# EAGLE design T2BasicSerialSplitterRevC (EAGLE 7.7.0)
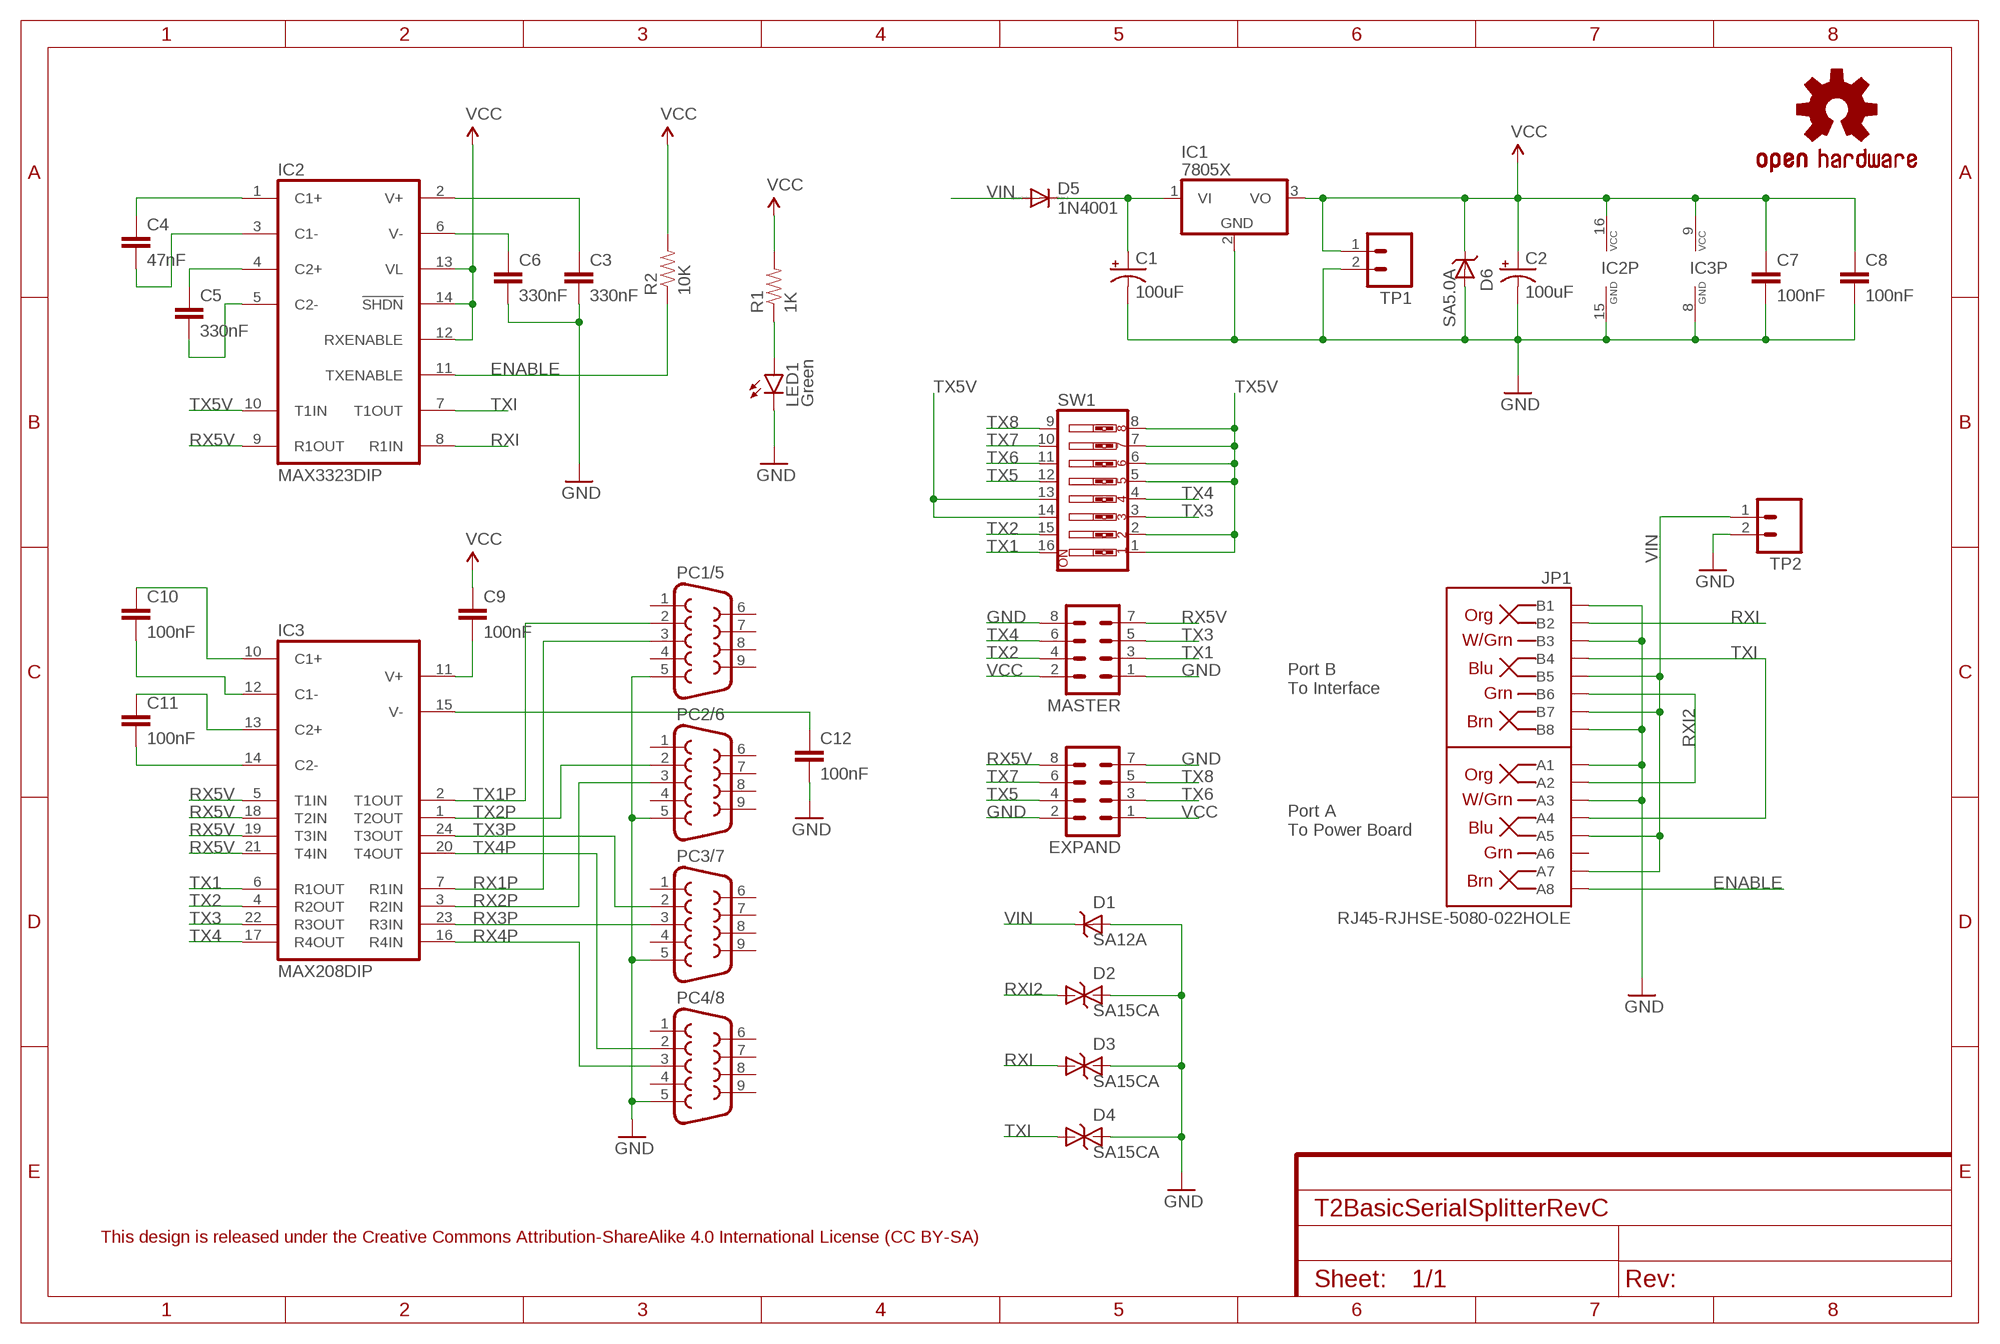
[diagram p0: schematic, sheet 1]
FRAME2 (FRAME-A4L): CNAME: Type 2 Basic Serial Splitter; CREVISION: Rev C 08/2019; DESIGNER: A J Instone-Cowie

## Parts
C1  100uF  CAP_POLPTH1  [CPOL-RADIAL-100UF-25V]
C2  100uF  CAP_POLPTH1  [CPOL-RADIAL-100UF-25V]
C3  330nF  CAPPTH  [CAP-PTH-SMALL]
C4  47nF  CAPPTH  [CAP-PTH-SMALL]
C5  330nF  CAPPTH  [CAP-PTH-SMALL]
C6  330nF  CAPPTH  [CAP-PTH-SMALL]
C7  100nF  CAPPTH  [CAP-PTH-SMALL]
C8  100nF  CAPPTH  [CAP-PTH-SMALL]
C9  100nF  CAPPTH  [CAP-PTH-SMALL]
C10  100nF  CAPPTH  [CAP-PTH-SMALL]
C11  100nF  CAPPTH  [CAP-PTH-SMALL]
C12  100nF  CAPPTH  [CAP-PTH-SMALL]
D1  SA12A  [DO41_TVS_UNI]
D2  SA15CA  [DO41_TVS_BI]
D3  SA15CA  [DO41_TVS_BI]
D4  SA15CA  [DO41_TVS_BI]
D5  1N4001  [DO41_DIODE]
D6  SA5.0A  [DO41_TVS_UNI]
EXPAND  M04X2POL  [2X4-POLARISED]
IC1  7805X  [TO220H]
IC2  MAX3323DIP  [DIL16]
IC3  MAX208DIP  [DIL24]
JP1  RJ45-RJHSE-5080-022HOLE  [RJ45-RJHSE-5080-02]
LED1  Green  LED-LH3MM  [LED3MM_LARGEHOLES]
LOGO1  OSHW-LOGOS  [OSHW-LOGO-S]
MASTER  M04X2POL  [2X4-POLARISED]
PC1/5  DB9-CONNECTOR-PCBFEMALE  [MULTICOMP-DB9-FEMALE-PCB-90DEG]
PC2/6  DB9-CONNECTOR-PCBFEMALE  [MULTICOMP-DB9-FEMALE-PCB-90DEG]
PC3/7  DB9-CONNECTOR-PCBFEMALE  [MULTICOMP-DB9-FEMALE-PCB-90DEG]
PC4/8  DB9-CONNECTOR-PCBFEMALE  [MULTICOMP-DB9-FEMALE-PCB-90DEG]
R1  1K  RESISTORPTH-1/4W  [AXIAL-0.4]
R2  10K  RESISTORPTH-1/4W  [AXIAL-0.4]
SW1  SW_DIP-8  [DIPSWITCH-08]
TP1  M02PTH  [1X02]
TP2  M02PTH  [1X02]

## Nets
ENABLE: IC2.11(TXENABLE) JP1.A8 R2.P$1
GND: C1.2(-) C2.2(-) C3.2 C6.2 C7.2 C8.2 C12.2 D1.ANODE D2.C D3.C D4.C D6.ANODE EXPAND.2 EXPAND.7 IC1.2(GND) IC2.15(GND) IC3.8(GND) JP1.A1 JP1.A3 JP1.B1 JP1.B3 JP1.B8 LED1.K(C) MASTER.1 MASTER.8 PC1/5.5 PC2/6.5 PC3/7.5 PC4/8.5 TP1.2 TP2.2
N$3: C3.1 IC2.2(V+)
N$4: C6.1 IC2.6(V-)
N$5: C5.1 IC2.4(C2+)
N$6: C5.2 IC2.5(C2-)
N$7: C4.1 IC2.1(C1+)
N$8: C4.2 IC2.3(C1-)
N$24: C11.2 IC3.14(C2-)
N$25: C11.1 IC3.13(C2+)
N$26: C10.1 IC3.10(C1+)
N$27: C10.2 IC3.12(C1-)
N$34: C12.1 IC3.15(V-)
N$35: C9.2 IC3.11(V+)
POWER_LED: LED1.A R1.P$1
RX1P: IC3.7(R1IN) PC1/5.3
RX2P: IC3.3(R2IN) PC2/6.3
RX3P: IC3.23(R3IN) PC3/7.3
RX4P: IC3.16(R4IN) PC4/8.3
RX5V: EXPAND.8 IC2.9(R1OUT) IC3.5(T1IN) IC3.18(T2IN) IC3.19(T3IN) IC3.21(T4IN) MASTER.7
RXI: D3.A IC2.8(R1IN) JP1.B2
RXI2: D2.A JP1.A2 JP1.B6
TX1: IC3.6(R1OUT) MASTER.3 SW1.16
TX1P: IC3.2(T1OUT) PC1/5.2
TX2: IC3.4(R2OUT) MASTER.4 SW1.15
TX2P: IC3.1(T2OUT) PC2/6.2
TX3: IC3.22(R3OUT) MASTER.5 SW1.3
TX3P: IC3.24(T3OUT) PC3/7.2
TX4: IC3.17(R4OUT) MASTER.6 SW1.4
TX4P: IC3.20(T4OUT) PC4/8.2
TX5: EXPAND.4 SW1.12
TX5V: IC2.10(T1IN) SW1.1 SW1.2 SW1.5 SW1.6 SW1.7 SW1.8 SW1.13 SW1.14
TX6: EXPAND.3 SW1.11
TX7: EXPAND.6 SW1.10
TX8: EXPAND.5 SW1.9
TXI: D4.A IC2.7(T1OUT) JP1.A4 JP1.B4
VCC: C2.1(+) C7.1 C8.1 C9.1 D6.CATHODE EXPAND.1 IC1.3(VO) IC2.12(RXENABLE) IC2.13(VL) IC2.14(!SHDN) IC2.16(VCC) IC3.9(VCC) MASTER.2 R1.P$2 R2.P$2 TP1.1
VIN: D1.CATHODE D5.A JP1.A5 JP1.A7 JP1.B5 JP1.B7 TP2.1
VREG_IN: C1.1(+) D5.C IC1.1(VI)
Unconnected: JP1.A6 PC1/5.1 PC1/5.4 PC1/5.6 PC1/5.7 PC1/5.8 PC1/5.9 PC2/6.1 PC2/6.4 PC2/6.6 PC2/6.7 PC2/6.8 PC2/6.9 PC3/7.1 PC3/7.4 PC3/7.6 PC3/7.7 PC3/7.8 PC3/7.9 PC4/8.1 PC4/8.4 PC4/8.6 PC4/8.7 PC4/8.8 PC4/8.9

## Notes on the sheet
- Port B
  To Interface
- Port A
  To Power Board
- This design is released under the Creative Commons Attribution-ShareAlike 4.0 International License (CC BY-SA)

## Library data of the parts
C1 C2 = SparkFun-Passives:CAP_POL: Capacitor Polarized These are standard SMD and PTH capacitors. Normally 10uF, 47uF, and 100uF in electrolytic and tantalum varieties. Always verify the external diameter of the through hole cap, it varies with capacity, voltage, and manufacturer. The EIA devices should be standard.
C3-C12 = SparkFun-Capacitors:CAP: Capacitor Standard 0603 ceramic capacitor, and 0.1" leaded capacitor.
D1 = AIC_Custom:SA12A: SA12A TVS Uni-Directional Transient Voltage Suppressor. 12V, DO41 package
D2-D4 = AIC_Custom:SA15CA: SA15CA TVS Bi-Directional Transient Voltage Suppressor. 15V, DO41 package
D5 = AIC_Custom:1N4001: DIODE general purpose rectifier, 1 A
D6 = AIC_Custom:SA5.0A: SA5.0A TVS Uni-Directional Transient Voltage Suppressor. 5V, DO41 package
EXPAND MASTER = AIC_Custom:M04X2: .1" header, two rows of four.
IC1 = AIC_Custom:7805: Custom TO-220 Voltage Regulator Package has additional footprint on layer 51 tDocu showing outline of TSR-1-2450 switching regulator
IC2 = AIC_Custom:MAX3323: RS232 TRANSCEIVER
IC3 = AIC_Custom:MAX208: RS232 TRANSCEIVER
JP1 = AIC_Custom:RJ45-RJHSE-5080-02: Amphenol RJHSE-x080 RJ45 PCB Jack (2-Port) RJ45 8-pin connection PCB PTH connector, 2-Port 90 degree package 3 Hole variant has extra hole to allow a single port socket to fitted to position A if position B is not required.
LED1 = AIC_Custom:LED-LH: LEDs Standard schematic elements and footprints for 5mm, 3mm, 1206, and 0603 sized LEDs. 5mm - Spark Fun Electronics SKU : COM-00529 (and others). Custom variant with larger (0.04") holes suitable for header pins as an alternative.
LOGO1 = SparkFun-Aesthetics:OSHW-LOGO: Open Source Hardware Logo This logo indicates the piece of hardware it is found on incorporates a OSHW license and/or adheres to the definition of open source hardware found here: http://freedomdefined.org/OSHW
PC1/5 PC2/6 PC3/7 PC4/8 = AIC_Custom:DB9-CONNECTOR-PCB: DB9 Connector Multicomp PCB Right-Angle DB9 Connector Female 5504F1-09S-02A-03
R1 R2 = SparkFun-Passives:RESISTOR: Resistor Basic schematic elements and footprints for 0603, 1206, and PTH resistors.
SW1 = AIC_Custom:SW_DIP-8: DIP Switch 8 Position
TP1 TP2 = SparkFun-Connectors:M02: Standard 2-pin 0.1" header. Use with - straight break away headers ( PRT-00116) - right angle break away headers (PRT-00553) - swiss pins (PRT-00743) - machine pins (PRT-00117) - female headers (PRT-00115) Molex polarized connector foot print use with: PRT-08233 with associated crimp pins and housings. 2.54_SCREWTERM for use with PRT-10571. 3.5mm Screw Terminal footprints for PRT-08084 5mm Screw Terminal footprints for use with PRT-08432

## Board
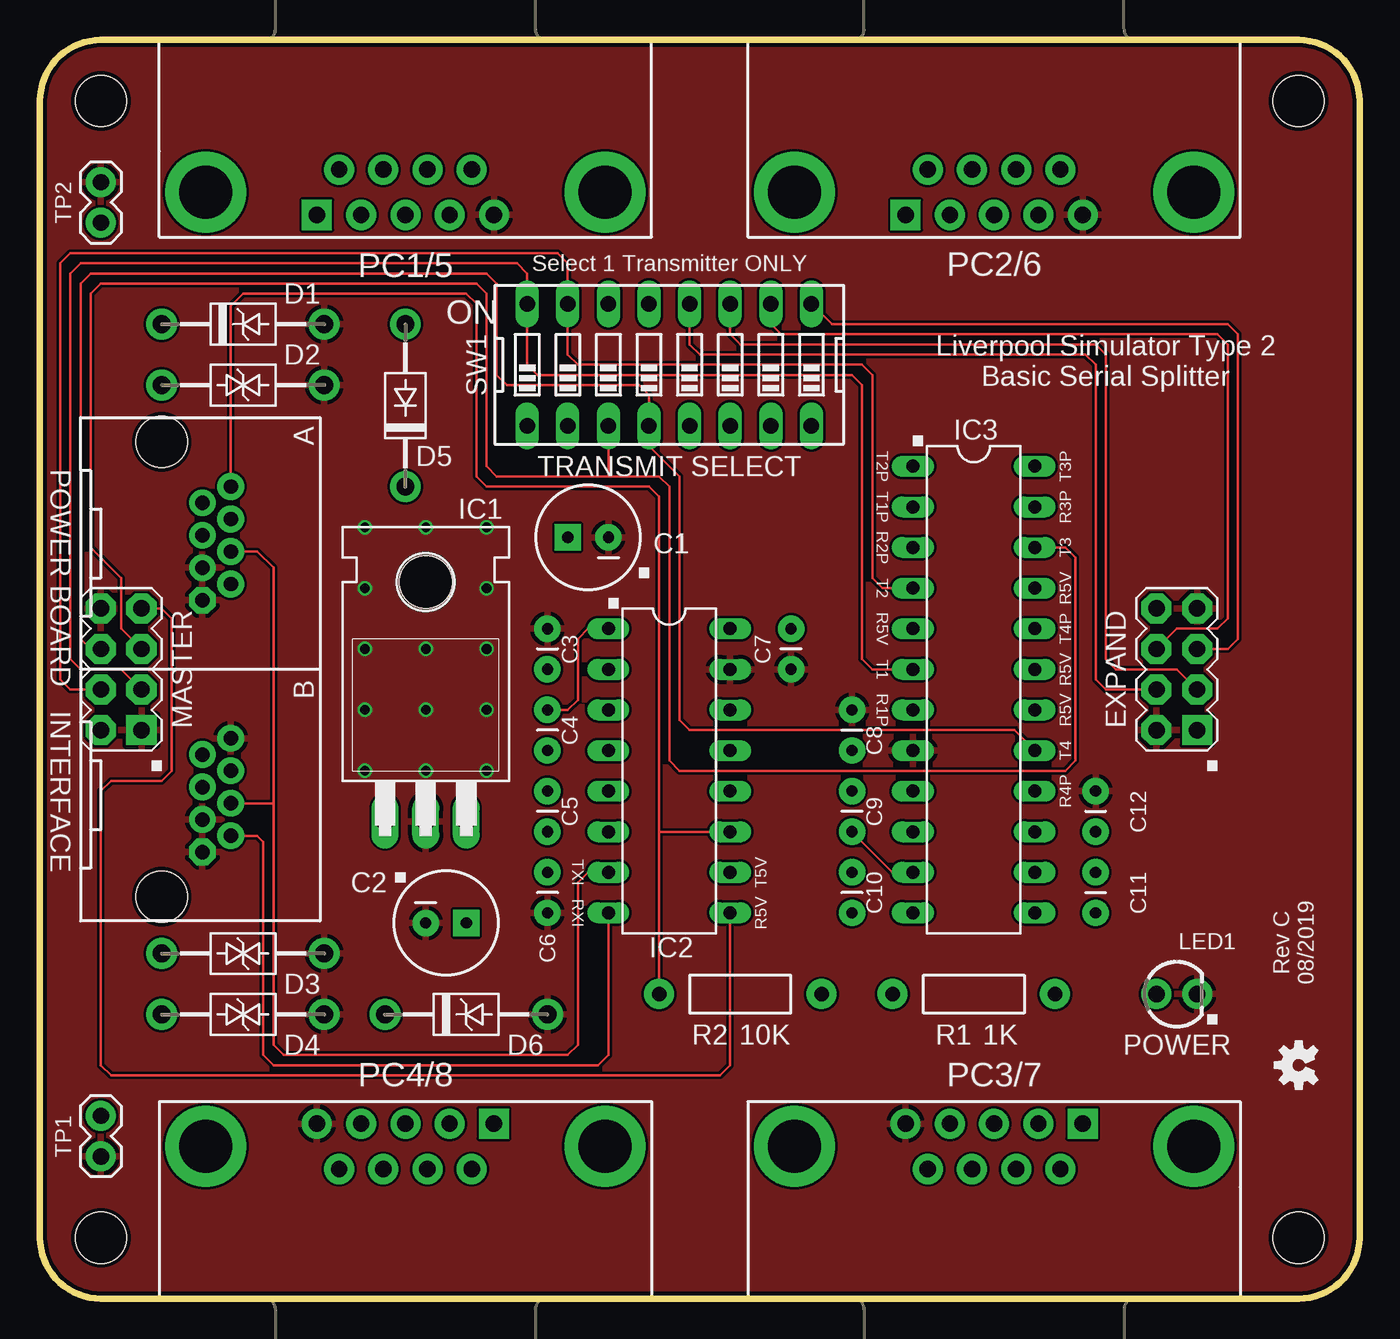
[diagram p1: board, top side]
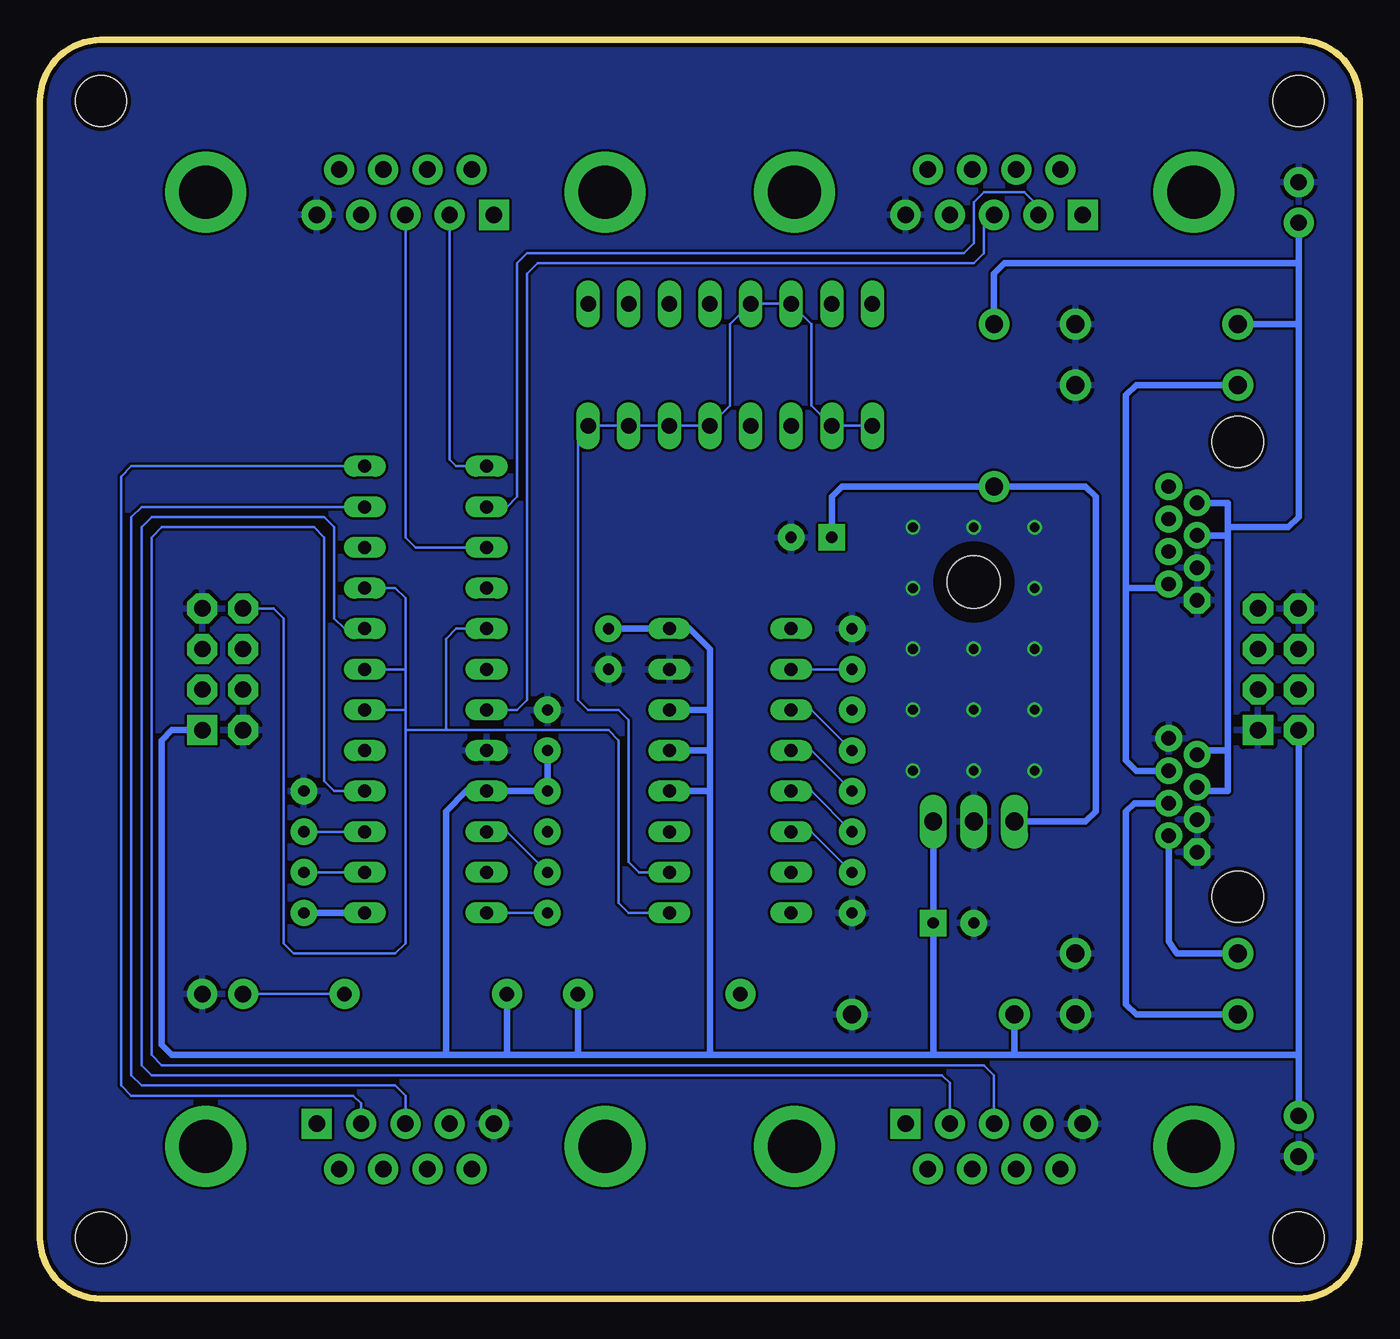
[diagram p2: board, bottom side, seen from below]

Size 82.55 x 78.74 mm. Coordinates in mm from the lower left corner, seen from the top.
Outline: 3.81,78.74 78.74,78.74 arc-90 82.55,74.93 82.55,3.81 arc-90 78.74,0 3.81,0 arc-90 0,3.81 0,74.93 arc-90 3.81,78.74
Copper layers (1*16): Top 0.035mm / dielectric 1.5mm / Bottom 0.035mm
Design rules "SeeedStudio_2layer_DRU_no_angle_20140221": minimum track width 6mil, minimum drill 12mil, track to track 6mil, track to pad 6mil, pad to pad 6mil, via to via 6mil, smd to smd 0mil, copper to edge 10mil, drill to drill 10mil, minimum pad ring 10mil, minimum via ring 6mil, stop-mask expansion 2mil, vias tented up to drill 100mil, thermal gap 10mil
Holes 3.2 mm at 3.81,74.93 78.74,74.93 3.81,3.81 78.74,3.81

### Footprints (pad centres in the part's own frame; a part is rotated, then mirrored left to right if it is on the bottom)
CPOL-RADIAL-100UF-25V = drill 0.7 pad 1.651 square: 1 1.27,0 | drill 0.7 pad 1.651: 2 -1.27,0
CAP-PTH-SMALL = drill 0.7 pad 1.651: 1 0,0; 2 2.54,0
DO41_TVS_UNI = drill 1.118 pad 1.93: ANODE -5.08,0; CATHODE 5.08,0
DO41_TVS_BI = drill 1.118 pad 1.93: A 5.08,0; C -5.08,0
DO41_DIODE = drill 1.118 pad 1.93: A 5.08,0; C -5.08,0
2X4-POLARISED = drill 1.016 pad 1.88 square: 1 -3.81,-1.27 | drill 1.016 pad 1.88 octagon: 2 -3.81,1.27; 3 -1.27,-1.27; 4 -1.27,1.27; 5 1.27,-1.27; 6 1.27,1.27; 7 3.81,-1.27; 8 3.81,1.27
TO220H = drill 1.118 long: 1 -2.54,-10.16; 2 0,-10.16; 3 2.54,-10.16 | hole 3.302: 0,4.826
DIL16 = drill 0.813 long: 1 -8.89,-3.81; 2 -6.35,-3.81; 3 -3.81,-3.81; 4 -1.27,-3.81; 5 1.27,-3.81; 6 3.81,-3.81; 7 6.35,-3.81; 8 8.89,-3.81; 9 8.89,3.81; 10 6.35,3.81; 11 3.81,3.81; 12 1.27,3.81; 13 -1.27,3.81; 14 -3.81,3.81; 15 -6.35,3.81; 16 -8.89,3.81
DIL24 = drill 0.813 long: 1 -13.97,-3.81; 2 -11.43,-3.81; 3 -8.89,-3.81; 4 -6.35,-3.81; 5 -3.81,-3.81; 6 -1.27,-3.81; 7 1.27,-3.81; 8 3.81,-3.81; 9 6.35,-3.81; 10 8.89,-3.81; 11 11.43,-3.81; 12 13.97,-3.81; 13 13.97,3.81; 14 11.43,3.81; 15 8.89,3.81; 16 6.35,3.81; 17 3.81,3.81; 18 1.27,3.81; 19 -1.27,3.81; 20 -3.81,3.81; 21 -6.35,3.81; 22 -8.89,3.81; 23 -11.43,3.81; 24 -13.97,3.81
RJ45-RJHSE-5080-02 = drill 0.9 pad 1.676 octagon: A1 -4.318,2.54; B1 11.43,2.54 | drill 0.9 pad 1.676: A2 -5.334,4.318; A3 -6.35,2.54; A4 -7.366,4.318; A5 -8.382,2.54; A6 -9.398,4.318; A7 -10.414,2.54; A8 -11.43,4.318; B2 10.414,4.318; B3 9.398,2.54; B4 8.382,4.318; B5 7.366,2.54; B6 6.35,4.318; B7 5.334,2.54; B8 4.318,4.318 | hole 3.2: -14.224,0; 14.224,0
LED3MM_LARGEHOLES = drill 1.016 pad 1.88: A -1.27,0; K 1.27,0
MULTICOMP-DB9-FEMALE-PCB-90DEG = drill 1.016 pad 1.88 square: 1 -5.54,-10.945 | drill 1.016 pad 1.88: 2 -2.77,-10.945; 3 0,-10.945; 4 2.77,-10.945; 5 5.54,-10.945; 6 -4.15,-8.105; 7 -1.38,-8.105; 8 1.38,-8.105; 9 4.15,-8.105 | drill 3.302 pad 5.08: G1 -12.496,-9.525; G2 12.496,-9.525
AXIAL-0.4 = drill 0.9 pad 1.88: P$1 -5.08,0; P$2 5.08,0
DIPSWITCH-08 = drill 0.97 long: 1 -8.89,-3.81; 2 -6.35,-3.81; 3 -3.81,-3.81; 4 -1.27,-3.81; 5 1.27,-3.81; 6 3.81,-3.81; 7 6.35,-3.81; 8 8.89,-3.81; 9 8.89,3.81; 10 6.35,3.81; 11 3.81,3.81; 12 1.27,3.81; 13 -1.27,3.81; 14 -3.81,3.81; 15 -6.35,3.81; 16 -8.89,3.81
1X02 = drill 1.016 pad 1.88: 1 0,0; 2 2.54,0

### Placement (x,y rotation side)
C1  34.29,47.62 180 top
C2  25.4,23.5 0 top
C3  31.75,39.37 90 top
C4  31.75,36.83 270 top
C5  31.75,31.75 270 top
C6  31.75,26.67 270 top
C7  46.99,41.91 270 top
C8  50.8,34.29 90 top
C9  50.8,31.75 270 top
C10  50.8,26.67 270 top
C11  66.04,24.13 90 top
C12  66.04,29.21 90 top
D1  12.7,60.96 180 top
D2  12.7,57.15 180 top
D3  12.7,21.59 180 top
D4  12.7,17.78 180 top
D5  22.86,55.88 90 top
D6  26.67,17.78 180 top
EXPAND  71.12,39.37 90 top
IC1  24.13,40 0 top
IC2  39.37,33.02 270 top
IC3  58.42,38.1 270 top
JP1  7.62,39.37 270 top
LED1  71.12,19.05 0 top
LOGO1  78.74,14.61 90 top
MASTER  5.08,39.37 90 top
PC1/5  22.86,78.74 0 top
PC2/6  59.69,78.74 0 top
PC3/7  59.69,0 180 top
PC4/8  22.86,0 180 top
R1  58.42,19.05 180 top
R2  43.82,19.05 0 top
SW1  39.37,58.42 0 top
TP1  3.81,11.43 270 top
TP2  3.81,67.31 90 top

### Tracks (layer width: path | path; a pad name or v marks a point on that pad's centre or on a via)
ENABLE
  Top 0.152: R2.P$1 38.74,29.21 | 38.74,29.21 38.74,31.75 38.74,50.16 38.1,50.8 27.94,50.8 27.3,51.43 27.3,62.23 26.67,62.86 12.7,62.86 11.94,62.1 JP1.A8 | IC2.11 38.74,29.21
GND  (via drill 0.6 pad 0.25)
  other vias: 20.32,33.02 24.13,33.02 27.94,33.02 27.94,36.83 24.13,36.83 20.32,36.83 20.32,40.64 27.94,40.64 24.13,40.64 20.32,44.45 27.94,44.45 20.32,48.26 24.13,48.26 27.94,48.26
  pour Top: 3.81,78.74 78.74,78.74 arc-90 82.55,74.93 82.55,3.81 arc-90 78.74,0 3.81,0 arc-90 0,3.81 0,74.93 arc-90
  pour Bottom: 3.81,78.74 78.74,78.74 arc-90 82.55,74.93 82.55,3.81 arc-90 78.74,0 3.81,0 arc-90 0,3.81 0,74.93 arc-90
N$3
  Bottom 0.152: C3.1 IC2.2
N$4
  Bottom 0.152: C6.1 34.29,29.21 IC2.6
N$5
  Bottom 0.152: C5.1 34.29,34.29 IC2.4
N$6
  Bottom 0.152: C5.2 34.29,31.75 IC2.5
N$7
  Top 0.152: IC2.1 34.29,41.91 33.66,41.27 33.66,37.46 33.02,36.83 C4.1
N$8
  Bottom 0.152: C4.2 34.29,36.83 IC2.3
N$24
  Bottom 0.152: IC3.14 C11.2
N$25
  Bottom 0.406: IC3.13 C11.1
N$26
  Bottom 0.152: IC3.10 53.34,29.21 C10.1
N$27
  Bottom 0.152: C10.2 IC3.12
N$34
  Bottom 0.152: IC3.15 C12.1
N$35
  Top 0.152: IC3.11 53.34,26.67 C9.2
POWER_LED
  Bottom 0.152: LED1.A R1.P$1
RX1P
  Bottom 0.152: IC3.7 52.71,36.83 52.07,37.46 52.07,64.14 51.44,64.77 24.13,64.77 23.5,65.41 23.5,67.31 PC1/5.3
RX2P
  Bottom 0.152: IC3.3 59.05,46.99 59.69,47.62 PC2/6.3
RX3P
  Bottom 0.152: PC3/7.3 59.69,12.7 60.33,13.34 76.2,13.34 76.83,13.97 76.83,48.89 76.2,49.53 IC3.23
RX4P
  Bottom 0.152: PC4/8.3 22.86,13.97 23.5,14.61 74.93,14.61 75.56,15.24 75.56,47.62 74.93,48.26 65.41,48.26 64.77,47.62 64.77,32.38 64.14,31.75 IC3.16
RX5V
  Top 0.152: MASTER.7 7.62,43.18 8.26,42.54 8.26,33.02 7.62,32.38 4.45,32.38 3.81,31.75 3.81,14.61 4.45,13.97 42.55,13.97 43.18,14.61 IC2.9
  Bottom 0.152: IC2.9 45.72,24.13 46.36,24.77 46.36,34.92 46.99,35.56 57.15,35.56 | 57.15,35.56 57.15,41.27 56.52,41.91 IC3.5 | IC3.21 60.33,44.45 59.69,43.81 59.69,39.37 | 59.69,39.37 IC3.19 | IC3.18 59.69,36.83 | 59.69,36.83 59.69,39.37 | 57.15,35.56 59.69,35.56 | EXPAND.8 67.94,43.18 67.31,42.54 67.31,22.23 66.67,21.59 60.33,21.59 59.69,22.23 59.69,35.56 | 59.69,35.56 59.69,36.83
RXI
  Top 0.152: IC2.8 35.56,15.24 34.93,14.61 14.61,14.61 13.97,15.24 13.97,28.57 13.59,28.96 JP1.B2
  Bottom 0.406: D3.A 11.43,21.59 11.94,22.35 JP1.B2
RXI2
  Bottom 0.406: D2.A 13.97,57.15 14.61,56.52 14.61,44.45 | JP1.B6 13.97,33.02 14.61,33.66 14.61,44.45 | JP1.A2 11.94,44.45 14.61,44.45
TX1
  Top 0.152: MASTER.3 5.08,39.37 2.54,39.37 1.91,40 1.91,64.14 2.54,64.77 29.84,64.77 30.48,64.14 SW1.16 30.48,58.42 31.11,57.78 50.8,57.78 51.44,57.15 51.44,40 52.07,39.37 IC3.6
TX1P
  Bottom 0.152: IC3.2 53.34,49.53 52.71,50.16 52.71,64.77 52.07,65.41 24.77,65.41 24.13,66.04 24.13,68.58 23.5,69.22 20.95,69.22 20.09,68.35 PC1/5.2
TX2
  Top 0.152: MASTER.4 1.91,38.1 1.27,38.73 1.27,64.77 1.91,65.41 32.38,65.41 33.02,64.77 SW1.15 33.02,59.05 33.66,58.42 51.44,58.42 52.07,57.78 52.07,45.09 52.71,44.45 IC3.4
TX2P
  Bottom 0.152: IC3.1 56.52,52.07 56.92,52.47 PC2/6.2
TX3
  Top 0.152: MASTER.5 5.08,41.91 5.08,45.09 3.17,46.99 3.17,62.86 3.81,63.5 27.3,63.5 27.94,62.86 27.94,52.07 28.57,51.43 35.56,51.43 | SW1.3 35.56,51.43 | 35.56,51.43 38.74,51.43 39.37,50.8 39.37,33.66 40.01,33.02 64.14,33.02 64.77,33.66 64.77,46.35 64.14,46.99 IC3.22
TX3P
  Bottom 0.152: IC3.24 76.83,52.07 77.47,51.43 77.47,13.34 76.83,12.7 62.95,12.7 62.46,12.21 PC3/7.2
TX4
  Top 0.152: MASTER.6 3.17,40.64 2.54,41.27 2.54,63.5 3.17,64.14 27.94,64.14 28.57,63.5 28.57,57.78 29.21,57.15 37.47,57.15 38.1,56.52 SW1.4 38.1,53.34 40.01,51.43 40.01,36.2 40.64,35.56 60.96,35.56 IC3.17
TX4P
  Bottom 0.152: PC4/8.2 25.63,13.48 26.11,13.97 75.56,13.97 76.2,14.61 76.2,48.26 75.56,48.89 64.77,48.89 64.14,48.26 64.14,42.54 63.5,41.91 IC3.20
TX5
  Top 0.152: SW1.12 40.64,59.69 41.28,59.05 65.41,59.05 66.04,58.42 66.04,38.73 66.67,38.1 EXPAND.4
TX5V
  Bottom 0.152: IC2.10 45.09,26.67 45.72,27.3 45.72,36.2 46.36,36.83 48.26,36.83 48.9,37.46 48.9,53.97 SW1.8 SW1.7 SW1.6 SW1.5 39.37,55.88 39.37,60.96 SW1.13 SW1.14 34.29,60.96 34.29,55.88 SW1.2 SW1.1
TX6
  Top 0.152: SW1.11 43.18,60.32 43.82,59.69 66.04,59.69 66.67,59.05 66.67,40 67.31,39.37 71.12,39.37 EXPAND.3
TX7
  Top 0.152: SW1.10 45.72,60.96 46.36,60.32 73.66,60.32 74.3,59.69 74.3,42.54 73.66,41.91 71.12,41.91 EXPAND.6
TX8
  Top 0.152: SW1.9 49.53,60.96 50.17,60.96 74.3,60.96 74.93,60.32 74.93,41.27 74.3,40.64 EXPAND.5
TXI
  Top 0.152: JP1.B4 14.61,30.99 | 14.61,30.99 14.61,15.88 15.24,15.24 33.02,15.24 33.66,15.88 33.66,20.32 33.66,26.04 34.29,26.67 IC2.7 | JP1.A4 13.59,46.74 14.61,45.72 14.61,30.99
  Bottom 0.406: D4.A 13.97,17.78 14.61,18.41 14.61,30.48 14.1,30.99 JP1.B4
VCC
  Bottom 0.406: 53.34,15.24 48.9,15.24 | 48.9,15.24 40.64,15.24 | 40.64,15.24 26.67,15.24 | 26.67,15.24 C2.1 IC1.3 | 57.15,15.24 57.15,30.48 55.88,31.75 IC3.9 C9.1 C8.1 | IC2.14 40.64,36.83 | 40.64,36.83 40.64,34.29 | IC2.13 40.64,34.29 | 40.64,36.83 40.64,40.64 41.91,41.91 IC2.16 C7.1 | R1.P$2 53.34,15.24 | EXPAND.1 74.3,35.56 74.93,34.92 74.93,15.88 74.3,15.24 57.15,15.24 | 57.15,15.24 53.34,15.24 | MASTER.2 3.81,15.24 | 3.81,15.24 TP1.1 | 3.81,15.24 21.59,15.24 | 21.59,15.24 26.67,15.24 | 40.64,34.29 40.64,31.75 | 40.64,31.75 40.64,15.24 | D6.CATHODE 21.59,15.24 | R2.P$2 48.9,15.24 | IC2.12 40.64,31.75
VIN
  Bottom 0.406: 8.26,47.75 8.26,34.29 | 8.26,34.29 8.26,31.75 9.91,31.75 JP1.B5 | 8.26,34.29 9.91,34.29 JP1.B7 | 3.81,60.96 3.81,48.89 4.45,48.26 8.26,48.26 | D1.CATHODE 3.81,60.96 | JP1.A5 8.26,47.75 | 8.26,47.75 8.26,48.26 | JP1.A7 8.26,49.78 8.26,48.26 | D5.A 22.86,64.14 22.22,64.77 3.81,64.77 | TP2.1 3.81,64.77 | 3.81,64.77 3.81,60.96
VREG_IN
  Bottom 0.406: IC1.1 17.14,29.85 16.51,30.48 16.51,50.16 17.14,50.8 D5.C 32.38,50.8 33.02,50.16 C1.1

### Text on the board
tPlace: Select 1 Transmitter ONLY | Liverpool Simulator Type 2 / Basic Serial Splitter | TRANSMIT SELECT | T2P | T3P | T1P | R3P | R2P | T3 | T2 | R5V | R5V | T4P | T1 | R5V | R1P | R5V | T4 | R4P | POWER BOARD INTERFACE | TXI | T5V | RXI | R5V | Rev C / 08/2019 | POWER